# EAGLE design t_eau (EAGLE 9.1.0)
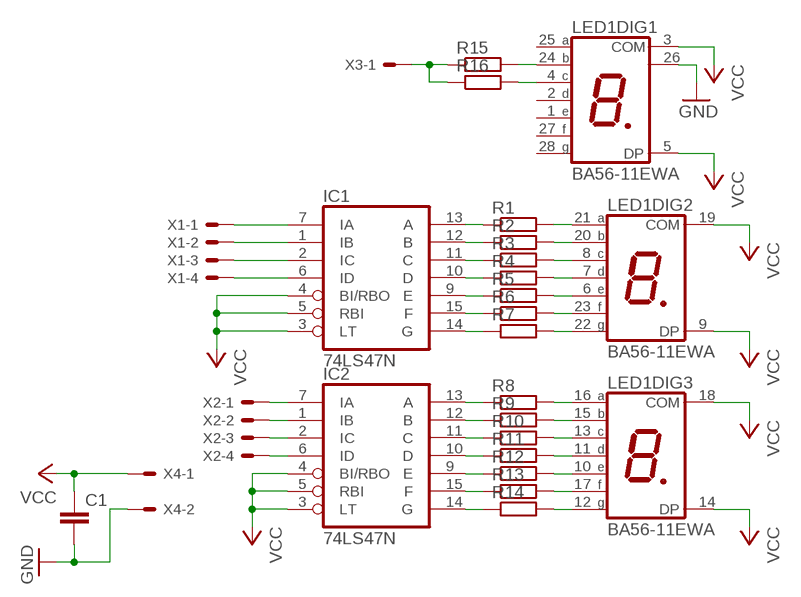
[diagram p0: schematic, sheet 1]

## Parts
C1  C-EU025-025X050  [C025-025X050]
IC1  74LS47N  [DIL16]
IC2  74LS47N  [DIL16]
LED1  BA56-11EWA  [BA/BC56]
R1  R-EU_0204/7  [0204/7]
R2  R-EU_0204/7  [0204/7]
R3  R-EU_0204/7  [0204/7]
R4  R-EU_0204/7  [0204/7]
R5  R-EU_0204/7  [0204/7]
R6  R-EU_0204/7  [0204/7]
R7  R-EU_0204/7  [0204/7]
R8  R-EU_0204/7  [0204/7]
R9  R-EU_0204/7  [0204/7]
R10  R-EU_0204/7  [0204/7]
R11  R-EU_0204/7  [0204/7]
R12  R-EU_0204/7  [0204/7]
R13  R-EU_0204/7  [0204/7]
R14  R-EU_0204/7  [0204/7]
R15  R-EU_0204/7  [0204/7]
R16  R-EU_0204/7  [0204/7]
X1  KK-156-7  [KK-156-7]
X2  KK-156-7  [KK-156-7]
X3  KK-156-2  [KK-156-2]
X4  KK-156-2  [KK-156-2]

## Nets
GND: C1.2 LED1.26(DIG1:COM) X4.2
N$1: LED1.21(DIG2:A) R1.2
N$2: IC1.12(B) R2.1
N$3: IC1.11(C) R3.1
N$4: IC1.10(D) R4.1
N$5: IC1.9(E) R5.1
N$6: IC1.15(F) R6.1
N$7: IC1.14(G) R7.1
N$8: IC2.13(A) R8.1
N$9: IC2.12(B) R9.1
N$10: IC2.11(C) R10.1
N$11: IC2.10(D) R11.1
N$12: IC2.9(E) R12.1
N$13: IC2.15(F) R13.1
N$14: IC2.14(G) R14.1
N$15: IC1.13(A) R1.1
N$16: LED1.12(DIG3:G) R14.2
N$17: LED1.17(DIG3:F) R13.2
N$18: LED1.10(DIG3:E) R12.2
N$19: LED1.11(DIG3:D) R11.2
N$20: LED1.13(DIG3:C) R10.2
N$21: LED1.15(DIG3:B) R9.2
N$22: IC1.7(IA) X1.1
N$23: IC1.1(IB) X1.2
N$24: IC1.2(IC) X1.3
N$25: IC1.6(ID) X1.4
N$26: LED1.16(DIG3:A) R8.2
N$27: LED1.22(DIG2:G) R7.2
N$28: LED1.23(DIG2:F) R6.2
N$29: LED1.6(DIG2:E) R5.2
N$30: LED1.7(DIG2:D) R4.2
N$31: LED1.8(DIG2:C) R3.2
N$32: LED1.4(DIG1:C) R16.2
N$33: LED1.24(DIG1:B) R15.2
N$34: LED1.20(DIG2:B) R2.2
N$35: IC2.7(IA) X2.1
N$36: IC2.1(IB) X2.2
N$37: IC2.2(IC) X2.3
N$38: IC2.6(ID) X2.4
N$39: R15.1 R16.1 X3.1
VCC: C1.1 IC1.3(LT) IC1.4(BI/RBO) IC1.5(RBI) IC2.3(LT) IC2.4(BI/RBO) IC2.5(RBI) LED1.3(DIG1:COM) LED1.5(DIG1:DP) LED1.9(DIG2:DP) LED1.14(DIG3:DP) LED1.18(DIG3:COM) LED1.19(DIG2:COM) X4.1
Unconnected: LED1.1(DIG1:E) LED1.2(DIG1:D) LED1.25(DIG1:A) LED1.27(DIG1:F) LED1.28(DIG1:G) X1.5 X1.6 X1.7 X2.5 X2.6 X2.7 X3.2

## Power pins joined to a net without a drawn wire
GND: IC1.8(GND) IC2.8(GND)
VCC: IC1.16(VCC) IC2.16(VCC)

## Library data of the parts
C1 = rcl:C-EU: CAPACITOR, European symbol
IC1 IC2 = 74xx-eu:74*47: BCD to seven segment DECODER/DRIVER Source: http://www.ee.washington.edu/stores/DataSheets/74ls/74ls47.pdf
LED1 = display-kingbright:B?56-11*WA: 14.22mm (0.56INCH) THREE DIGIT NUMERIC DISPLAY Source: http://www.kingbright.com .. BA56-11EWA(Ver1189474895.pdf; OC_FARNELL: unknown; OC_NEWARK: unknown
R1-R16 = resistor:R-EU_: RESISTOR, European symbol
X1 X2 = con-molex:KK-156-7: KK 156 HEADER Source: http://www.molex.com/pdm_docs/sd/026604100_sd.pdf; OC_FARNELL: unknown; OC_NEWARK: unknown
X3 X4 = con-molex:KK-156-2: KK 156 HEADER Source: http://www.molex.com/pdm_docs/sd/026604100_sd.pdf; OC_FARNELL: unknown; OC_NEWARK: unknown

## Board
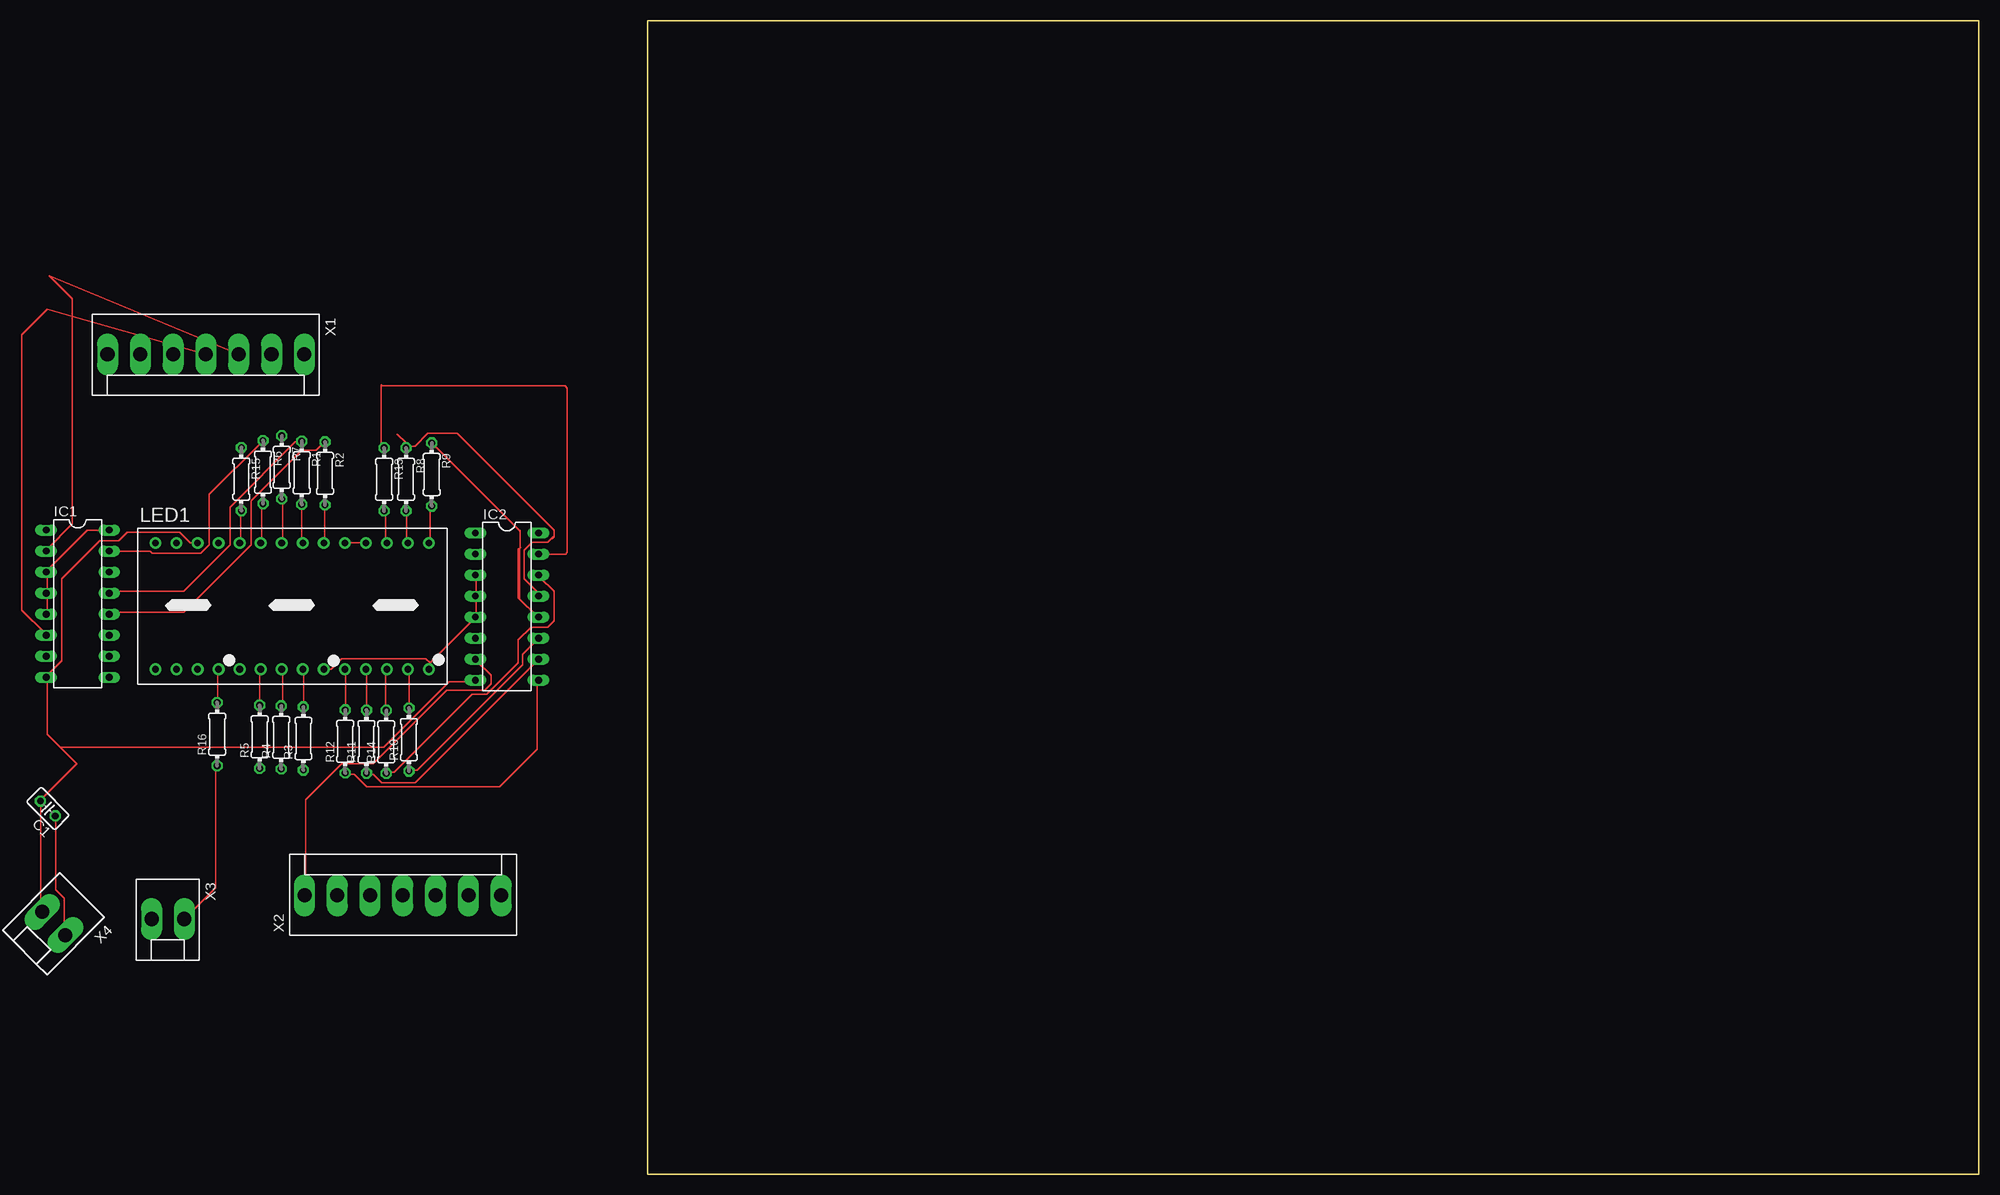
[diagram p1: board, top side]
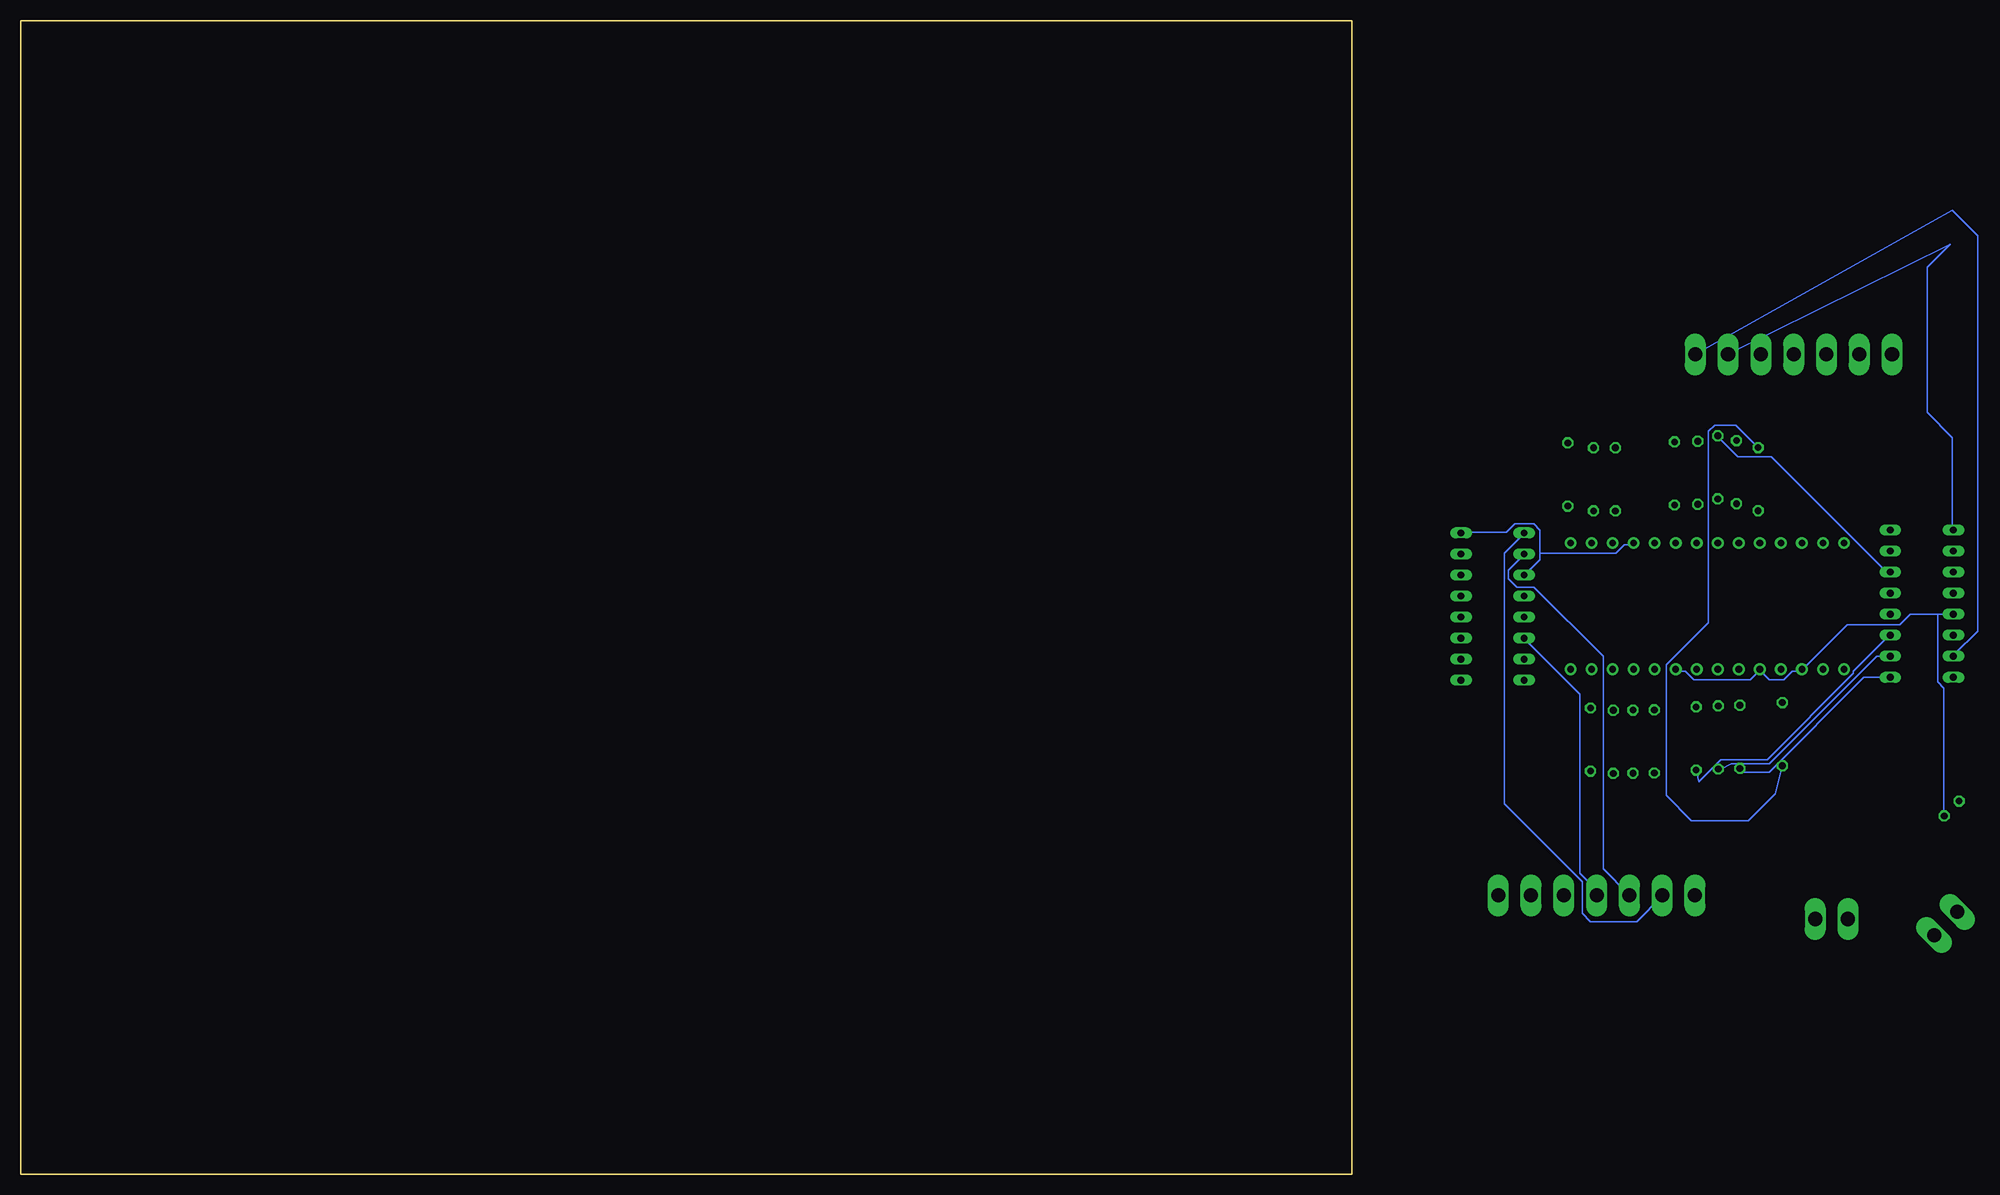
[diagram p2: board, bottom side, seen from below]

Size 160.78 x 139.27 mm. Coordinates in mm from the lower left corner, seen from the top.
Outline: 0,139.27 0,0 160.78,0 160.78,139.27 0,139.27
Copper layers (1*16): Top 0.035mm / dielectric 1.5mm / Bottom 0.035mm
Design rules "default *": minimum track width 6mil, minimum drill 0.35mm, track to track 14mil, track to pad 14mil, pad to pad 14mil, via to via 14mil, smd to smd 6mil, copper to edge 40mil, drill to drill 6mil, minimum pad ring 10mil, minimum via ring 8mil, stop-mask expansion 4mil, vias tented up to drill 0mil, thermal gap 10mil

### Footprints (pad centres in the part's own frame; a part is rotated, then mirrored left to right if it is on the bottom)
C025-025X050 = drill 0.813 octagon: 1 -1.27,0; 2 1.27,0
DIL16 = drill 0.813 long: 1 -8.89,-3.81; 2 -6.35,-3.81; 3 -3.81,-3.81; 4 -1.27,-3.81; 5 1.27,-3.81; 6 3.81,-3.81; 7 6.35,-3.81; 8 8.89,-3.81; 9 8.89,3.81; 10 6.35,3.81; 11 3.81,3.81; 12 1.27,3.81; 13 -1.27,3.81; 14 -3.81,3.81; 15 -6.35,3.81; 16 -8.89,3.81
BA/BC56 = drill 0.8 pad 1.422: 1 -16.51,-7.62; 2 -13.97,-7.62; 3 -11.43,-7.62; 4 -8.89,-7.62; 5 -6.35,-7.62; 6 -3.81,-7.62; 7 -1.27,-7.62; 8 1.27,-7.62; 9 3.81,-7.62; 10 6.35,-7.62; 11 8.89,-7.62; 12 11.43,-7.62; 13 13.97,-7.62; 14 16.51,-7.62; 15 16.51,7.62; 16 13.97,7.62; 17 11.43,7.62; 18 8.89,7.62; 19 6.35,7.62; 20 3.81,7.62; 21 1.27,7.62; 22 -1.27,7.62; 23 -3.81,7.62; 24 -6.35,7.62; 25 -8.89,7.62; 26 -11.43,7.62; 27 -13.97,7.62; 28 -16.51,7.62
0204/7 = drill 0.813 octagon: 1 -3.81,0; 2 3.81,0
KK-156-7 = drill 1.7 pad 2.184 long: 1 -11.88,0; 2 -7.92,0; 3 -3.96,0; 4 0,0; 5 3.96,0; 6 7.92,0; 7 11.88,0
KK-156-2 = drill 1.7 pad 2.184 long: 1 -1.98,0; 2 1.98,0

### Placement (x,y rotation side)
C1  -72.41,44.15 135 top  (outside the outline)
IC1  -68.81,68.88 270 top  (outside the outline)
IC2  -16.97,68.53 270 top  (outside the outline)
LED1  -42.9,68.58 0 top  (outside the outline)
R1  -41.76,84.68 270 top  (outside the outline)
R2  -38.94,84.61 270 top  (outside the outline)
R3  -41.55,52.6 90 top  (outside the outline)
R4  -44.22,52.73 90 top  (outside the outline)
R5  -46.84,52.81 90 top  (outside the outline)
R6  -46.43,84.76 270 top  (outside the outline)
R7  -44.17,85.34 270 top  (outside the outline)
R8  -29.16,83.9 270 top  (outside the outline)
R9  -26.06,84.48 270 top  (outside the outline)
R10  -28.8,52.48 90 top  (outside the outline)
R11  -33.93,52.22 90 top  (outside the outline)
R12  -36.5,52.25 90 top  (outside the outline)
R13  -31.8,83.9 270 top  (outside the outline)
R14  -31.55,52.2 90 top  (outside the outline)
R15  -49.05,83.92 270 top  (outside the outline)
R16  -51.97,53.12 90 top  (outside the outline)
X1  -53.33,98.98 180 top  (outside the outline)
X2  -29.54,33.66 0 top  (outside the outline)
X3  -57.91,30.81 180 top  (outside the outline)
X4  -71.69,30.26 135 top  (outside the outline)

### Tracks (layer width: path | path; a pad name or v marks a point on that pad's centre or on a via)
GND
  Top 0.152: X4.2 -73.25,31.78 -73.25,44.98 C1.2 -73.25,45.24 -68.94,49.56 -70.94,51.56 | -70.94,51.56 -31.88,51.56 -23.98,59.46 -20.93,59.46 IC2.8 | LED1.26 -54.46,76.23 -55.22,76.23 -56.49,77.5 -62.84,77.5 -63.86,76.48 -66.14,76.48 -70.71,71.91 -70.71,62 -72.49,60.22 IC1.8 -72.49,59.97 -72.49,53.11 -70.94,51.56
N$1
  Top 0.152: R1.2 -41.76,76.23 LED1.21
N$2
  Top 0.152: IC1.12 -64.87,67.84 -55.98,67.84 -47.85,75.97 -47.85,81.31 -41.76,87.4 -39.98,87.4 -38.96,88.42 R2.1
N$3
  Bottom 0.152: IC1.11 -64.87,65.05 -60.55,60.73 -60.55,60.48 -50.14,50.06 -44.55,50.06 -41.9,47.41 R3.1
N$4
  Bottom 0.152: IC1.10 -64.87,62.51 -63.35,62.51 -50.39,49.56 -45.82,49.56 -44.55,48.92 R4.1
N$5
  Bottom 0.152: IC1.9 -64.87,59.97 -61.82,59.97 -50.39,48.54 -47.03,48.54 R5.1
N$6
  Top 0.152: R6.1 -52.93,82.07 -52.93,75.97 -53.95,74.96 -59.79,74.96 -60.05,75.21 -64.87,75.21 IC1.15
N$7
  Bottom 0.152: IC1.14 -64.87,72.92 -64.36,72.92 -50.65,86.64 -46.58,86.64 -44.3,88.93 R7.1
N$8
  Top 0.152: -11.58,76.79 -12.04,76.33 -13.91,76.33 -14.91,75.33 -14.91,71.89 -13.16,70.13 IC2.13 | -11.58,76.79 -11.4,76.97 | -30.2,89.33 -29.16,88.29 R8.1 -29.06,87.91 -28.04,87.91 -26.52,89.43 -22.96,89.43 -11.28,77.75 -11.28,76.99 -11.53,76.73 -11.58,76.79
N$9
  Top 0.152: -15.39,75.72 -15.39,75.57 -15.42,75.54 -15.42,69.52 | -15.39,75.72 -15.39,77.62 | -15.39,77.62 -15.39,77.72 | -15.39,77.62 R9.1 | IC2.12 -13.31,67.34 -15.6,69.62 -15.6,75.46 -15.34,75.72 -15.39,75.72
N$10
  Top 0.152: R10.1 -28.8,48.79 -27.79,48.79 -15.09,61.49 -15.09,62.76 -13.31,64.54 IC2.11
N$11
  Top 0.152: R11.1 -33.88,48.29 -33.12,48.29 -32.11,47.27 -28.04,47.27 -13.31,62 IC2.10
N$12
  Top 0.152: R12.1 -36.42,48.29 -35.41,48.29 -33.88,46.76 -17.88,46.76 -13.31,51.33 -13.31,59.46 IC2.9
N$13
  Top 0.152: IC2.15 -9.88,74.88 -9.68,75.08 -9.68,94.92 -9.96,95.2 -32.03,95.2 -32.16,95.33 -32.16,88.06 R13.1
N$14
  Top 0.152: IC2.14 -13.16,72 | IC2.14 -13.11,72.34 | R14.1 -31.34,48.54 -30.58,48.54 -21.18,57.94 -19.41,57.94 -15.6,61.75 -15.6,64.54 -14.07,66.07 -12.04,66.07 -11.28,66.83 -11.28,70.38 -13.06,72.16 IC2.14
N$15
  Top 0.152: IC1.13 -64.87,70.38 -55.98,70.38 -50.39,75.97 -50.39,80.54 -42.52,88.42 -41.76,88.42 R1.1
N$16
  Top 0.152: R14.2 -31.6,56.16 -31.6,60.73 LED1.12
N$17
  Top 0.152: R13.2 -31.6,80.04 -31.6,76.23 LED1.17
N$18
  Top 0.152: R12.2 -36.42,56.16 -36.42,60.73 LED1.10
N$19
  Top 0.152: R11.2 -33.88,56.16 -33.88,60.73 LED1.11
N$20
  Top 0.152: R10.2 -28.8,60.73 LED1.13
N$21
  Top 0.152: R9.2 -26.26,80.54 -26.26,76.23 LED1.15
N$22
  Bottom 0.152: IC1.7 -72.75,62.76 -75.54,65.56 -75.54,113.31 -72.49,116.36 X1.1
N$23
  Bottom 0.152: IC1.1 -72.49,78 -72.49,88.93 -69.44,91.97 -69.44,109.5 -72.24,112.29 X1.2
N$24
  Top 0.152: IC1.2 -72.49,75.46 -69.44,78.51 -69.44,105.69 -72.24,108.48 X1.3
N$25
  Top 0.152: IC1.6 -72.75,65.3 -75.54,68.1 -75.54,101.37 -72.49,104.42 X1.4
N$26
  Top 0.152: R8.2 -29.06,80.04 -29.06,76.23 LED1.16
N$27
  Top 0.152: R7.2 -44.04,81.31 -44.04,76.23 LED1.22
N$28
  Top 0.152: R6.2 -46.58,80.8 -46.58,76.23 LED1.23
N$29
  Top 0.152: R5.2 -46.84,60.73 LED1.6
N$30
  Top 0.152: R4.2 -44.04,56.63 -44.04,60.73 LED1.7
N$31
  Top 0.152: R3.2 -41.5,56.62 -41.5,60.73 LED1.8
N$32
  Top 0.152: R16.2 -51.92,57 -51.92,60.73 LED1.4
N$33
  Top 0.152: R15.2 -49.12,80.04 -49.12,76.23 LED1.24
N$34
  Top 0.152: R2.2 -38.96,80.8 -38.96,76.23 LED1.20
N$35
  Top 0.152: IC2.7 -20.68,62 -18.9,60.22 -18.9,59.21 -19.66,58.45 -24.23,58.45 -33.12,49.56 -36.93,49.56 -41.25,45.24 -41.25,33.81 X2.1
  Bottom 0.152: -21.95,62 -20.93,62 IC2.7
N$36
  Bottom 0.152: IC2.1 -20.68,77.24 -18.39,74.96 -18.39,44.73 -27.79,35.33 -27.79,31.52 -28.8,30.51 -34.39,30.51 -37.44,33.55 X2.2
N$37
  Bottom 0.152: IC2.2 -20.68,74.7 -18.9,72.92 -18.9,71.91 -19.91,70.89 -21.95,70.89 -30.33,62.51 -30.33,36.86 -33.38,33.81 X2.3
N$38
  Bottom 0.152: -20.68,64.54 IC2.6 -20.93,64.54 -27.53,57.94 -27.53,36.35 -29.31,34.57 -29.31,33.81 X2.4
N$39
  Top 0.152: R16.1 -52.17,49.12 -52.17,34.57 -55.73,31.01 X3.1
  Bottom 0.152: R15.1 -48.87,87.91 -46.33,90.45 -43.79,90.45 -43.03,89.69 -43.03,66.57 -37.95,61.49 -37.95,45.75 -41,42.7 -47.85,42.7 -51.1,45.94 R16.1
VCC
  Top 0.152: C1.1 -71.48,43.21 -71.48,34.32 -70.46,33.3 -70.46,28.98 X4.1 | IC1.5 -72.49,67.84 -72.49,70.13 IC1.4 -72.49,70.38 -72.49,72.67 IC1.3 -72.49,72.92 -67.67,77.75 -65.13,77.75 IC1.16 | LED1.19 -36.42,76.23 -34.14,76.23 LED1.18 | IC2.3 -20.68,72.16 -20.68,69.88 IC2.4 -20.68,69.62 -20.68,67.34 IC2.5 -20.93,67.08 -26.26,61.75 | -26.26,61.75 -26.26,60.99 LED1.14 | -26.26,61.75 -26.77,62.26 -36.93,62.26 -38.2,60.99 -38.96,60.99 LED1.9
  Bottom 0.152: LED1.9 -39.22,60.73 -40.23,60.73 -41.25,59.72 -48.11,59.72 -49.12,60.73 LED1.5 -49.38,60.73 -50.39,59.72 -52.17,59.72 -53.19,60.73 -54.2,60.73 LED1.3 -54.46,60.99 -59.79,66.32 -66.14,66.32 -67.41,67.59 -70.71,67.59 | -22.71,74.96 -22.71,74.19 -20.93,72.42 IC2.3 | -22.71,74.96 -22.71,77.75 -21.95,78.51 -19.66,78.51 -18.64,77.5 -13.31,77.5 IC2.16 | -22.71,74.96 -31.85,74.96 -32.87,75.97 -33.88,75.97 LED1.18 | -70.71,67.59 -72.49,67.59 IC1.5 | -70.71,67.59 -70.71,59.46 -71.48,58.7 -71.48,43.46 C1.1